# Altium schematic sheet Con_midi_din5.schdoc: MIDI Connectors
size A4; DocumentNumber: 44; SheetNumber: 45; SheetTotal: 77
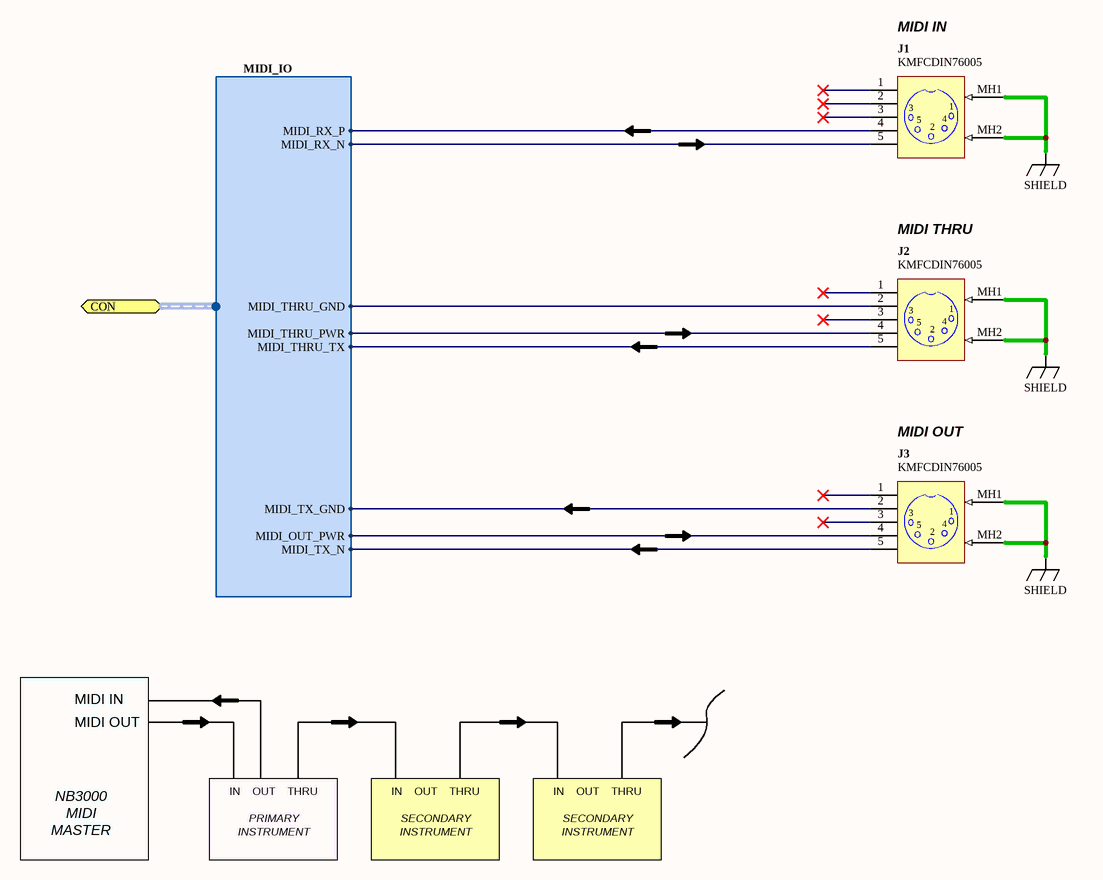
[diagram p0: Con_midi_din5.schdoc]

## Parts
J1  KMFCDIN76005  [KMFCDIN76005]
J2  KMFCDIN76005  [KMFCDIN76005]
J3  KMFCDIN76005  [KMFCDIN76005]

## Ports
CON (harness MIDI_IO)

## Harnesses
MIDI_IO: MIDI_RX_N, MIDI_RX_P, MIDI_THRU_TX, MIDI_TX_N, MIDI_OUT_PWR, MIDI_TX_GND, MIDI_THRU_GND, MIDI_THRU_PWR

## Nets
SHIELD: J1.MH1 J1.MH2 J2.MH1 J2.MH2 J3.MH1 J3.MH2
NetJ1_4: J1.4 ; port CON.MIDI_RX_P
NetJ1_5: J1.5 ; port CON.MIDI_RX_N
NetJ2_2: J2.2 ; port CON.MIDI_THRU_GND
NetJ2_4: J2.4 ; port CON.MIDI_THRU_PWR
NetJ2_5: J2.5 ; port CON.MIDI_THRU_TX
NetJ3_2: J3.2 ; port CON.MIDI_TX_GND
NetJ3_4: J3.4 ; port CON.MIDI_OUT_PWR
NetJ3_5: J3.5 ; port CON.MIDI_TX_N

Not connected (* = marked no-connect by the designer): J1 1* 2* 3*; J2 1* 3*; J3 1* 3*

## Notes on the sheet
- MIDI IN
- MIDI THRU
- MIDI OUT
- NB3000
- MIDI
- IN    OUT    THRU
- PRIMARY
- SECONDARY
- MASTER
- INSTRUMENT
- Sheet Title
- Project Title
- Size:
- Date:
- A4
- Assy:
- Time:
- Revision:
- Sheet
- of
- File:

## Library data of the parts
J1-J3 = D-300-0118: Socket, 5-way R/A DIN; Connector type: Right Angle; Max Current: mA; Mounting Technology: Through-Hole; Status: Unreleased; Category: Connector